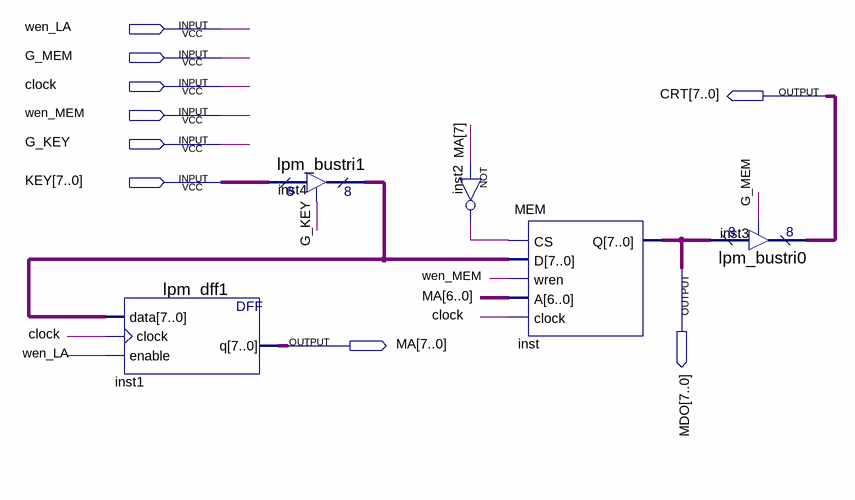
[diagram p0: schematic sheet]
// Quartus schematic Bus.bdf as structural Verilog: 5 symbols, 9 pins
module Bus (
  input  wen_LA,
  input  G_MEM,
  input  clock,
  input  wen_MEM,
  input  G_KEY,
  input  [7:0] KEY,
  output [7:0] CRT,
  output [7:0] MDO,
  output [7:0] MA
);

  wire inst2_out;
  wire [7:0] inst4_tridata;

  lpm_dff1 inst1 (.data(inst4_tridata), .clock(clock), .enable(wen_LA), .q(MA));
  lpm_bustri1 inst4 (.enabledt(G_KEY), .data(KEY), .tridata(inst4_tridata));
  not inst2 (inst2_out, MA[7]);
  MEM inst (.CS(inst2_out), .D(inst4_tridata), .wren(wen_MEM), .A(MA[6:0]), .clock(clock), .Q(MDO));
  lpm_bustri0 inst3 (.enabledt(G_MEM), .data(MDO), .tridata(CRT));
endmodule
